# Altium schematic sheet dac.SchDoc: DAC output
size A3; Author: Daniele Basile <asterix@develer.com>; Organization: Develer s.r.l.; Address1: via Mugellese 1/A; Address2: 50019 Campi Bisenzio; Address3: Firenze; Address4: ITALY; DocumentNumber: 9; Revision: A; SheetNumber: 9; SheetTotal: 10; Hw_rev: R1
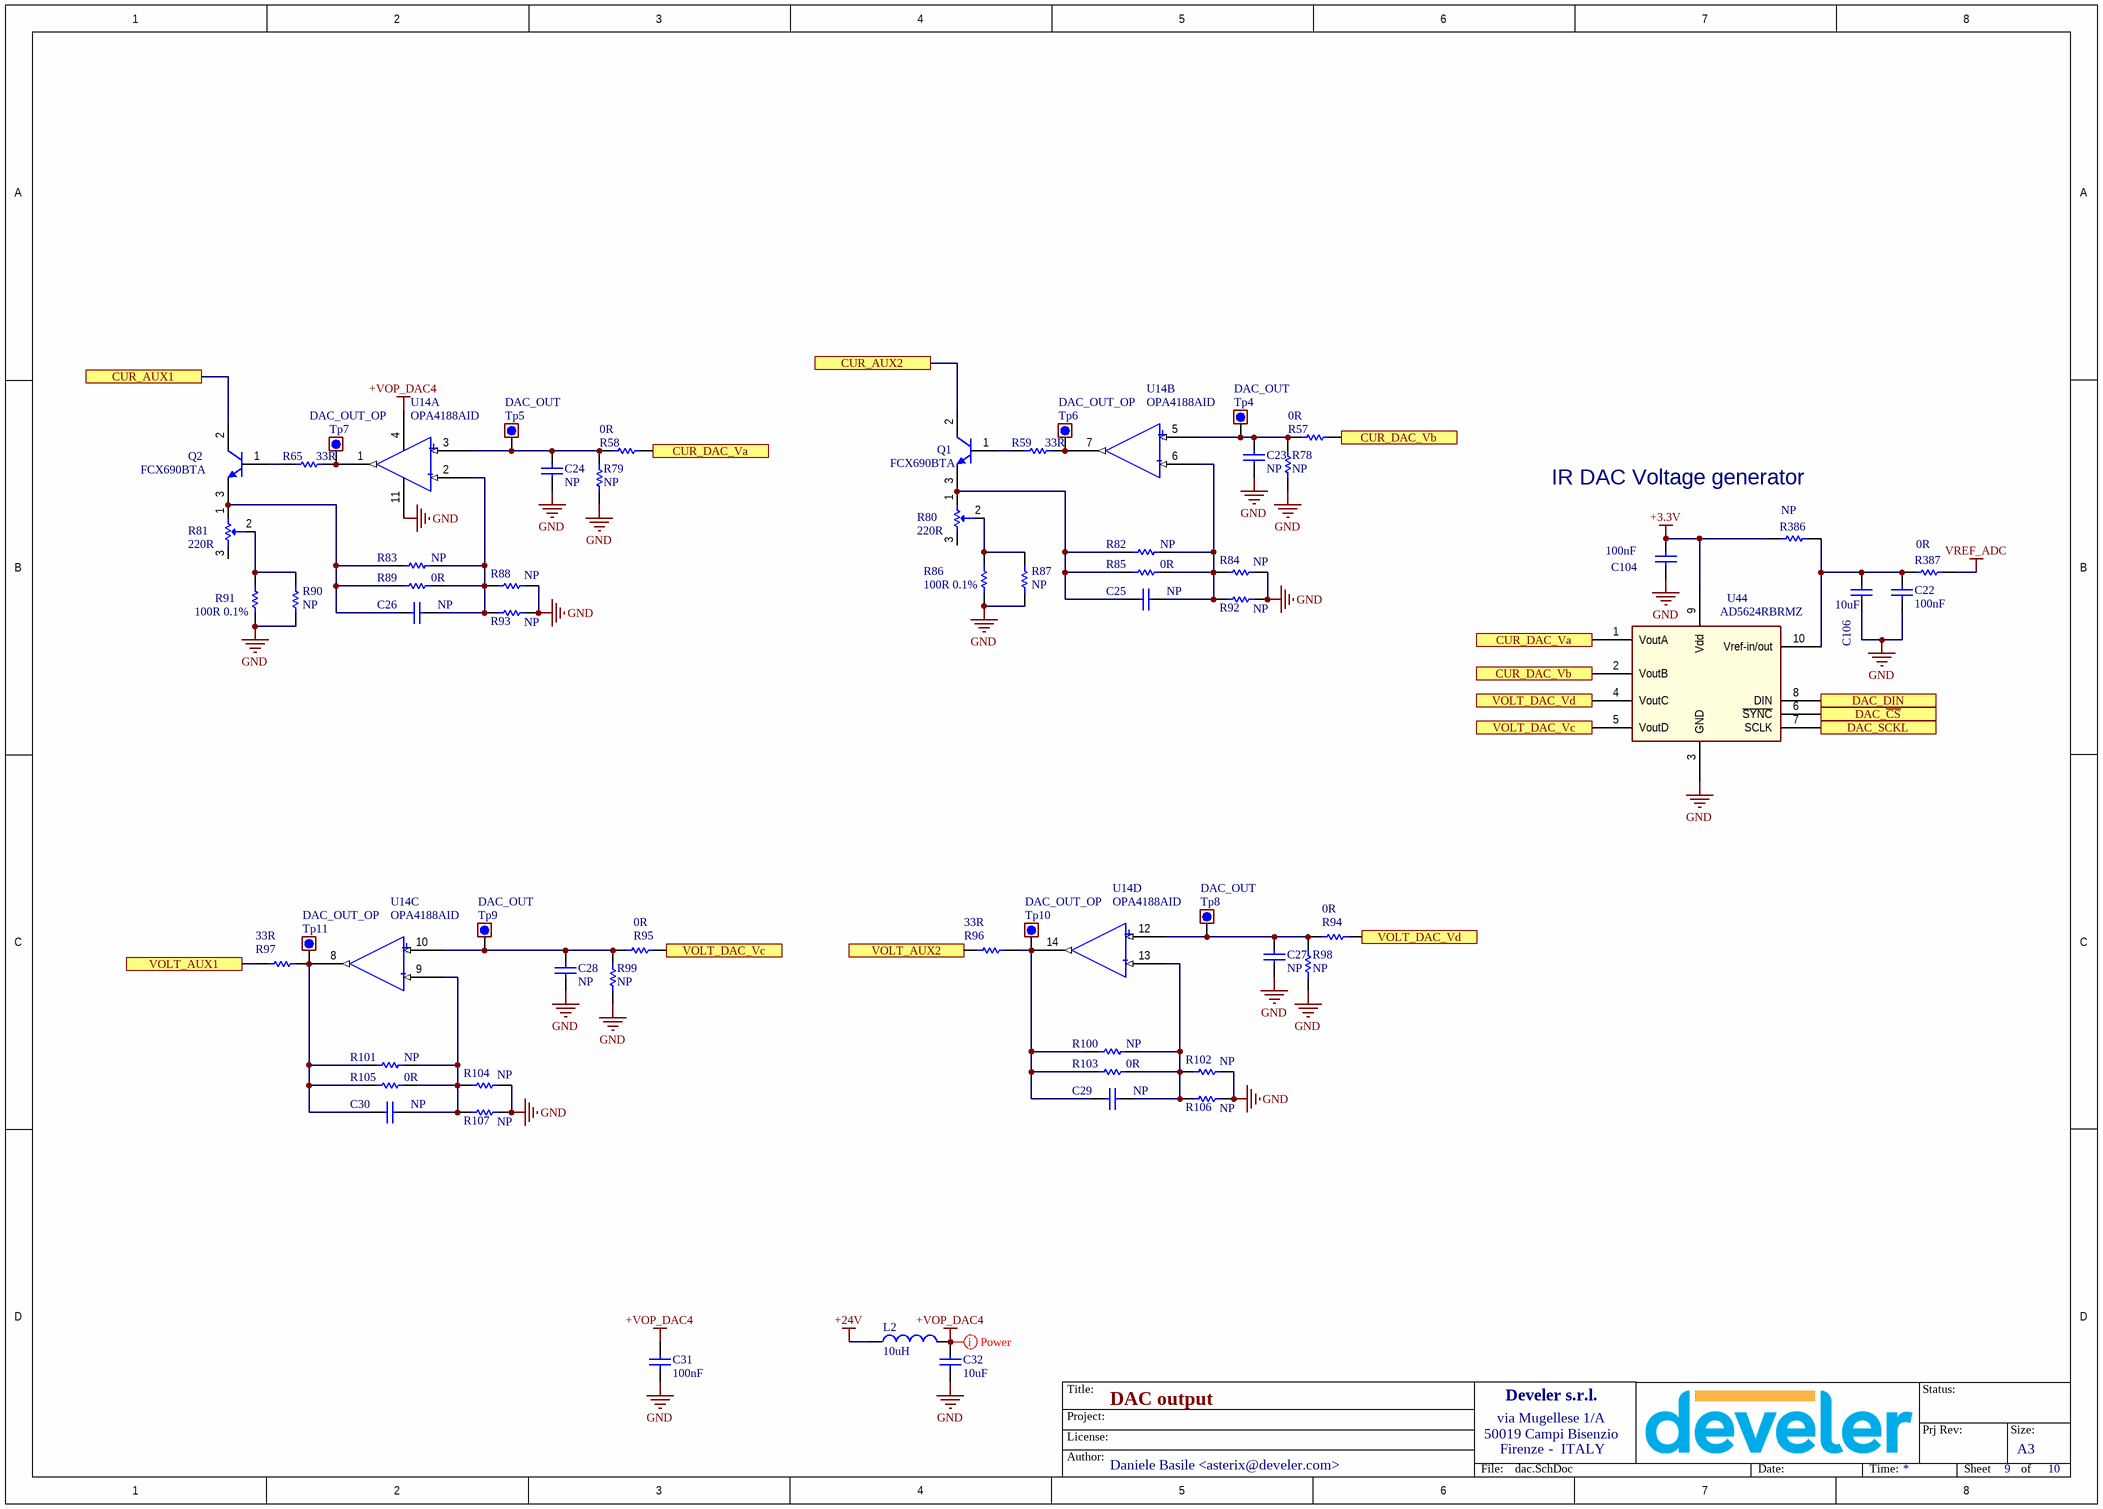
[diagram p0: dac.SchDoc]

## Parts
C22  100nF  [0603_[1608]]
C23  NP  [0603_[1608]]
C24  NP  [0603_[1608]]
C25  NP  [0603_[1608]]
C26  NP  [0603_[1608]]
C27  NP  [0603_[1608]]
C28  NP  [0603_[1608]]
C29  NP  [0603_[1608]]
C30  NP  [0603_[1608]]
C31  100nF  [0603_[1608]]
C32  10uF  [1206_[3216]]
C104  100nF  [0603_[1608]]
C106  10uF  [1206_[3216]]
L2  10uH  [1210_[3225]]
Q1  FCX690BTA  [SOT-89]
Q2  FCX690BTA  [SOT-89]
R57  0R  [0603_[1608]]
R58  0R  [0603_[1608]]
R59  33R  [0603_[1608]]
R65  33R  [0603_[1608]]
R78  NP  [0603_[1608]]
R79  NP  [0603_[1608]]
R80  220R  [TRIMMER_THD_5x10MM_HORIZONTAL]
R81  220R  [TRIMMER_THD_5x10MM_HORIZONTAL]
R82  NP  [0603_[1608]]
R83  NP  [0603_[1608]]
R84  NP  [0603_[1608]]
R85  0R  [0603_[1608]]
R86  100R 0.1%  [0805_[2012]]
R87  NP  [0805_[2012]]
R88  NP  [0603_[1608]]
R89  0R  [0603_[1608]]
R90  NP  [0805_[2012]]
R91  100R 0.1%  [0805_[2012]]
R92  NP  [0603_[1608]]
R93  NP  [0603_[1608]]
R94  0R  [0603_[1608]]
R95  0R  [0603_[1608]]
R96  33R  [0603_[1608]]
R97  33R  [0603_[1608]]
R98  NP  [0603_[1608]]
R99  NP  [0603_[1608]]
R100  NP  [0603_[1608]]
R101  NP  [0603_[1608]]
R102  NP  [0603_[1608]]
R103  0R  [0603_[1608]]
R104  NP  [0603_[1608]]
R105  0R  [0603_[1608]]
R106  NP  [0603_[1608]]
R107  NP  [0603_[1608]]
R386  NP  [0603_[1608]]
R387  0R  [0603_[1608]]
Tp4  DAC_OUT  [TEST_POINT_THD_D1.6MM]  (no BOM)
Tp5  DAC_OUT  [TEST_POINT_THD_D1.6MM]  (no BOM)
Tp6  DAC_OUT_OP  [TEST_POINT_THD_D1.6MM]  (no BOM)
Tp7  DAC_OUT_OP  [TEST_POINT_THD_D1.6MM]  (no BOM)
Tp8  DAC_OUT  [TEST_POINT_THD_D1.6MM]  (no BOM)
Tp9  DAC_OUT  [TEST_POINT_THD_D1.6MM]  (no BOM)
Tp10  DAC_OUT_OP  [TEST_POINT_THD_D1.6MM]  (no BOM)
Tp11  DAC_OUT_OP  [TEST_POINT_THD_D1.6MM]  (no BOM)
U14  OPA4188AID  [SOIC14]  (parts A,B,C,D of 4)
U44  AD5624RBRMZ  [MSOP50P490X110-10P]

## Ports
CUR_AUX1, CUR_AUX2, CUR_DAC_Va, CUR_DAC_Vb, DAC_DIN, DAC_SCKL, DAC_~{CS}, VOLT_AUX1, VOLT_AUX2, VOLT_DAC_Vc, VOLT_DAC_Vd

## Nets
+3.3V: C104.2 R386.2 U44.9(Vdd)
+24V: L2.1
+VOP_DAC4: C31.1 C32.2 L2.2 U14.4(V+)
GND: C22.2 C23.2 C24.2 C27.2 C28.2 C31.2 C32.1 C104.1 C106.1 R78.2 R79.2 R84.2 R86.1 R87.1 R88.2 R90.1 R91.1 R92.2 R93.2 R98.2 R99.2 R102.2 R104.2 R106.2 R107.2 U14.11(V-) U44.3(GND)
VREF_ADC: R387.1
CUR_AUX1: Q2.2(C) ; port CUR_AUX1
CUR_AUX2: Q1.2(C) ; port CUR_AUX2
CUR_DAC_Va: R58.1 U44.1(VoutA) ; port CUR_DAC_Va
CUR_DAC_Vb: R57.1 U44.2(VoutB) ; port CUR_DAC_Vb
DAC_~{CS}: U44.6(~{SYNC}) ; port DAC_~{CS}
DAC_DIN: U44.8(DIN) ; port DAC_DIN
DAC_SCKL: U44.7(SCLK) ; port DAC_SCKL
VOLT_AUX1: R97.1 ; port VOLT_AUX1
VOLT_AUX2: R96.1 ; port VOLT_AUX2
VOLT_DAC_Vc: R95.1 U44.5(VoutD) ; port VOLT_DAC_Vc
VOLT_DAC_Vd: R94.1 U44.4(VoutC) ; port VOLT_DAC_Vd
NetC22_1: C22.1 C106.2 R386.1 R387.2 U44.10(Vref-in/out)
NetC23_1: C23.1 R57.2 R78.1 Tp4.1 U14.5(IN+)
NetC24_1: C24.1 R58.2 R79.1 Tp5.1 U14.3(IN+)
NetC25_1: C25.1 R82.2 R84.1 R85.2 R92.1 U14.6(IN-)
NetC25_2: C25.2 Q1.3(E) R80.1 R82.1 R85.1
NetC26_1: C26.1 R83.2 R88.1 R89.2 R93.1 U14.2(IN-)
NetC26_2: C26.2 Q2.3(E) R81.1 R83.1 R89.1
NetC27_1: C27.1 R94.2 R98.1 Tp8.1 U14.12(IN+)
NetC28_1: C28.1 R95.2 R99.1 Tp9.1 U14.10(IN+)
NetC29_1: C29.1 R100.2 R102.1 R103.2 R106.1 U14.13(IN-)
NetC29_2: C29.2 R96.2 R100.1 R103.1 Tp10.1 U14.14(OUT)
NetC30_1: C30.1 R101.2 R104.1 R105.2 R107.1 U14.9(IN-)
NetC30_2: C30.2 R97.2 R101.1 R105.1 Tp11.1 U14.8(OUT)
NetQ1_1: Q1.1(B) R59.1
NetQ2_1: Q2.1(B) R65.1
NetR59_2: R59.2 Tp6.1 U14.7(OUT)
NetR65_2: R65.2 Tp7.1 U14.1(OUT)
NetR80_2: R80.2 R86.2 R87.2
NetR81_2: R81.2 R90.2 R91.2

Not connected (* = marked no-connect by the designer): R80 3; R81 3

## Layout directives
net class Power: +VOP_DAC4

## Notes on the sheet
- IR DAC Voltage generator
- Title:
- Status:
- Author:
- License:
- Project:
- -
- Prj Rev:
- Size:
- A3
- File:
- Date:
- Time:
- Sheet
- of
- (in symbol OpAmp, part A) +; -
- (in symbol OpAmp, part B) +; -
- (in symbol OpAmp, part C) +; -
- (in symbol OpAmp, part D) +; -

## Library data of the parts
C22-C31 C104 = Cap: Ceramic X7R 50V; Value: 100pF; Published: 8-Jun-2000; LatestRevisionDate: 17-Jul-2002; LatestRevisionNote: Re-released for DXP Platform.; PackageReference: RAD-0.3; Publisher: Altium Limited; PackageDescription: Radial Cap, Thru-Hole; 2 Leads; 0.3 in Pin Spacing
C32 C106 = Cap: Ceramic X7R 25V; Value: 100pF; Published: 8-Jun-2000; LatestRevisionDate: 17-Jul-2002; LatestRevisionNote: Re-released for DXP Platform.; PackageReference: RAD-0.3; Publisher: Altium Limited; PackageDescription: Radial Cap, Thru-Hole; 2 Leads; 0.3 in Pin Spacing
L2 = Inductor: INDUCTOR, 1210 CASE, 10.0UH (ELJPA100KF); Code_IEC: 1005; Value: 10mH; Published: 8-Jun-2000; LatestRevisionDate: 29-May-2009; LatestRevisionNote: IPC-7351 Footprint Added.; PackageReference: 0402-A; Publisher: Altium Limited; PackageDescription: Chip Inductor; Code_JEITA: 0402
Q1 Q2 = NPN: NPN Bipolar Transistor; Published: 8-Jun-2000; LatestRevisionDate: 17-Jul-2002; LatestRevisionNote: Re-released for DXP Platform.; PackageReference: TO-226-AA; Publisher: Altium Limited; PackageDescription: TO, Flat Index; 3 In-Line, Axial Leads; Body Dia. 4.8mm; Leads 0.55 x 0.51 mm (max); Code_JEDEC: TO-226-AA
R57-R59 R65 R78 R79 R82-R107 R386 R387 = Res1: Resistor; Revision: July-2002: Re-released for DXP Platform.
R80 R81 = Trimmer_3p: Trimmer 23 Turn 220ohm (T93YA221KT20;)
Tp4-Tp11 = Test_point: Test point
U14 = OpAmp: Quad Op Amp
U44 = AD5624R_BRMZ_MSOP: 12bit DAC